# Altium project Bridge load.PrjPcb
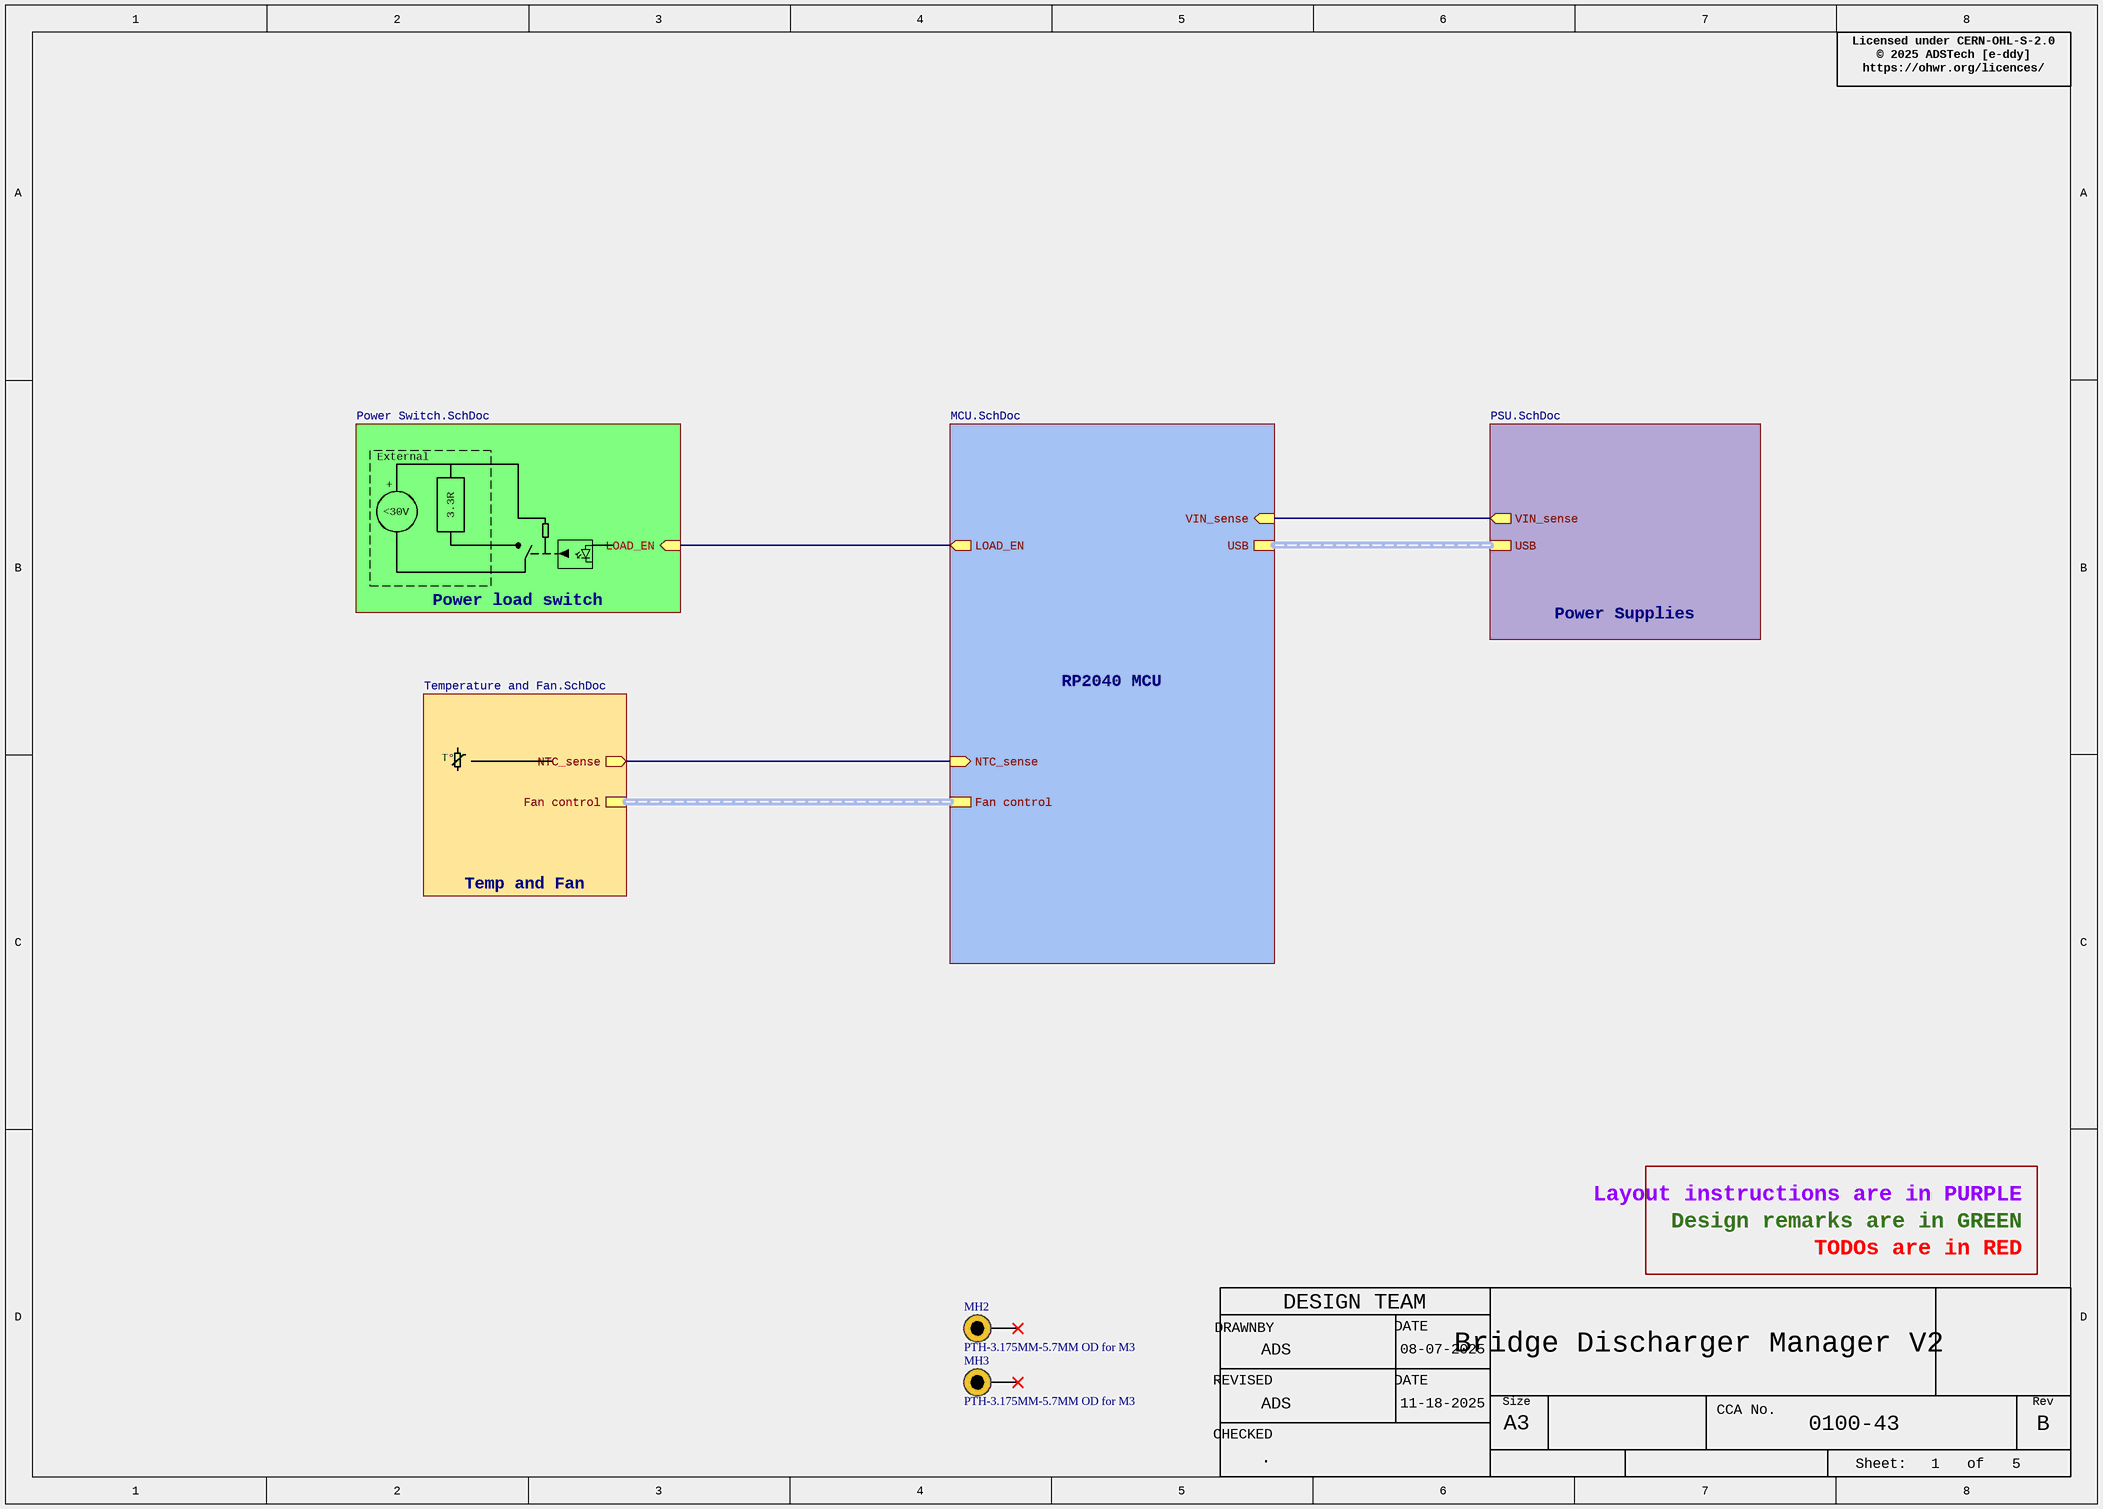
[diagram p0: Block diagram.SchDoc]
FIME_REVISED_DATE: 11-18-2025; FIME_REVISEDBY: ADS; FIME_DRAWN_DATE: 08-07-2025; FIME_DRAWNBY: ADS; FIME_CHECKEDBY: .; FIME_CCA_REVISION: B; FIME_CCA_Number: 0100-43; FIME_CCA_Description: Bridge Discharger Manager V2
5 sheets, 88 parts. Net scope: hierarchical (ports join the sheet entries above them; power ports are global).
Board file: Bridge Load V2.PcbDoc
Sheets:
  Block diagram.SchDoc
    Power load switch = Power Switch.SchDoc
    Power Supplies = PSU.SchDoc
    RP2040 MCU = MCU.SchDoc
    Temp and Fan = Temperature and Fan.SchDoc

## Sheet Block diagram.SchDoc
size A3; SheetNumber: 1; SheetTotal: 5

### Parts
MH2  PTH-3.175MM-5.7MM OD for M3  [PTH-3.175MM-5.7MM]  (net tie, no BOM)
MH3  PTH-3.175MM-5.7MM OD for M3  [PTH-3.175MM-5.7MM]  (net tie, no BOM)

### Sub-sheets
Power load switch = Power Switch.SchDoc: LOAD_EN (in)
Power Supplies = PSU.SchDoc: VIN_sense (out), USB (harness USB)
RP2040 MCU = MCU.SchDoc: Fan control (harness FAN_ctrl), LOAD_EN (out), NTC_sense (in), USB (harness USB), VIN_sense (in)
Temp and Fan = Temperature and Fan.SchDoc: Fan control (harness FAN_ctrl), NTC_sense (out)

### Nets
LOAD_EN: sheet Power load switch/LOAD_EN, sheet RP2040 MCU/LOAD_EN
NTC+: sheet RP2040 MCU/NTC_sense, sheet Temp and Fan/NTC_sense
VIN_sense: sheet Power Supplies/VIN_sense, sheet RP2040 MCU/VIN_sense

Not connected (* = marked no-connect by the designer): MH2 0*; MH3 0*

### Buses and harness runs
harness sheet Power Supplies/USB = sheet RP2040 MCU/USB
harness sheet RP2040 MCU/Fan control = sheet Temp and Fan/Fan control

### Notes on the sheet
- Licensed under CERN-OHL-S-2.0
  © 2025 ADSTech [e-ddy]
  https://ohwr.org/licences/
- External
- +
- <30V
- 3.3R
- T°
- Layout instructions are in PURPLE
- Design remarks are in GREEN
- TODOs are in RED
- DESIGN TEAM
- REVISED
- DRAWNBY
- DATE
- CHECKED
- Size
- A3
- CCA No.
- Sheet:
- of
- Rev

### Library data of the parts
MH2 MH3 = CMP-015-000006-2: 3.175mm/5.7mm PLATED TROUGH HOLE. For M3 Cylindrical hex screw head

## Sheet Power Switch.SchDoc
size A3; SheetNumber: 3; SheetTotal: 5
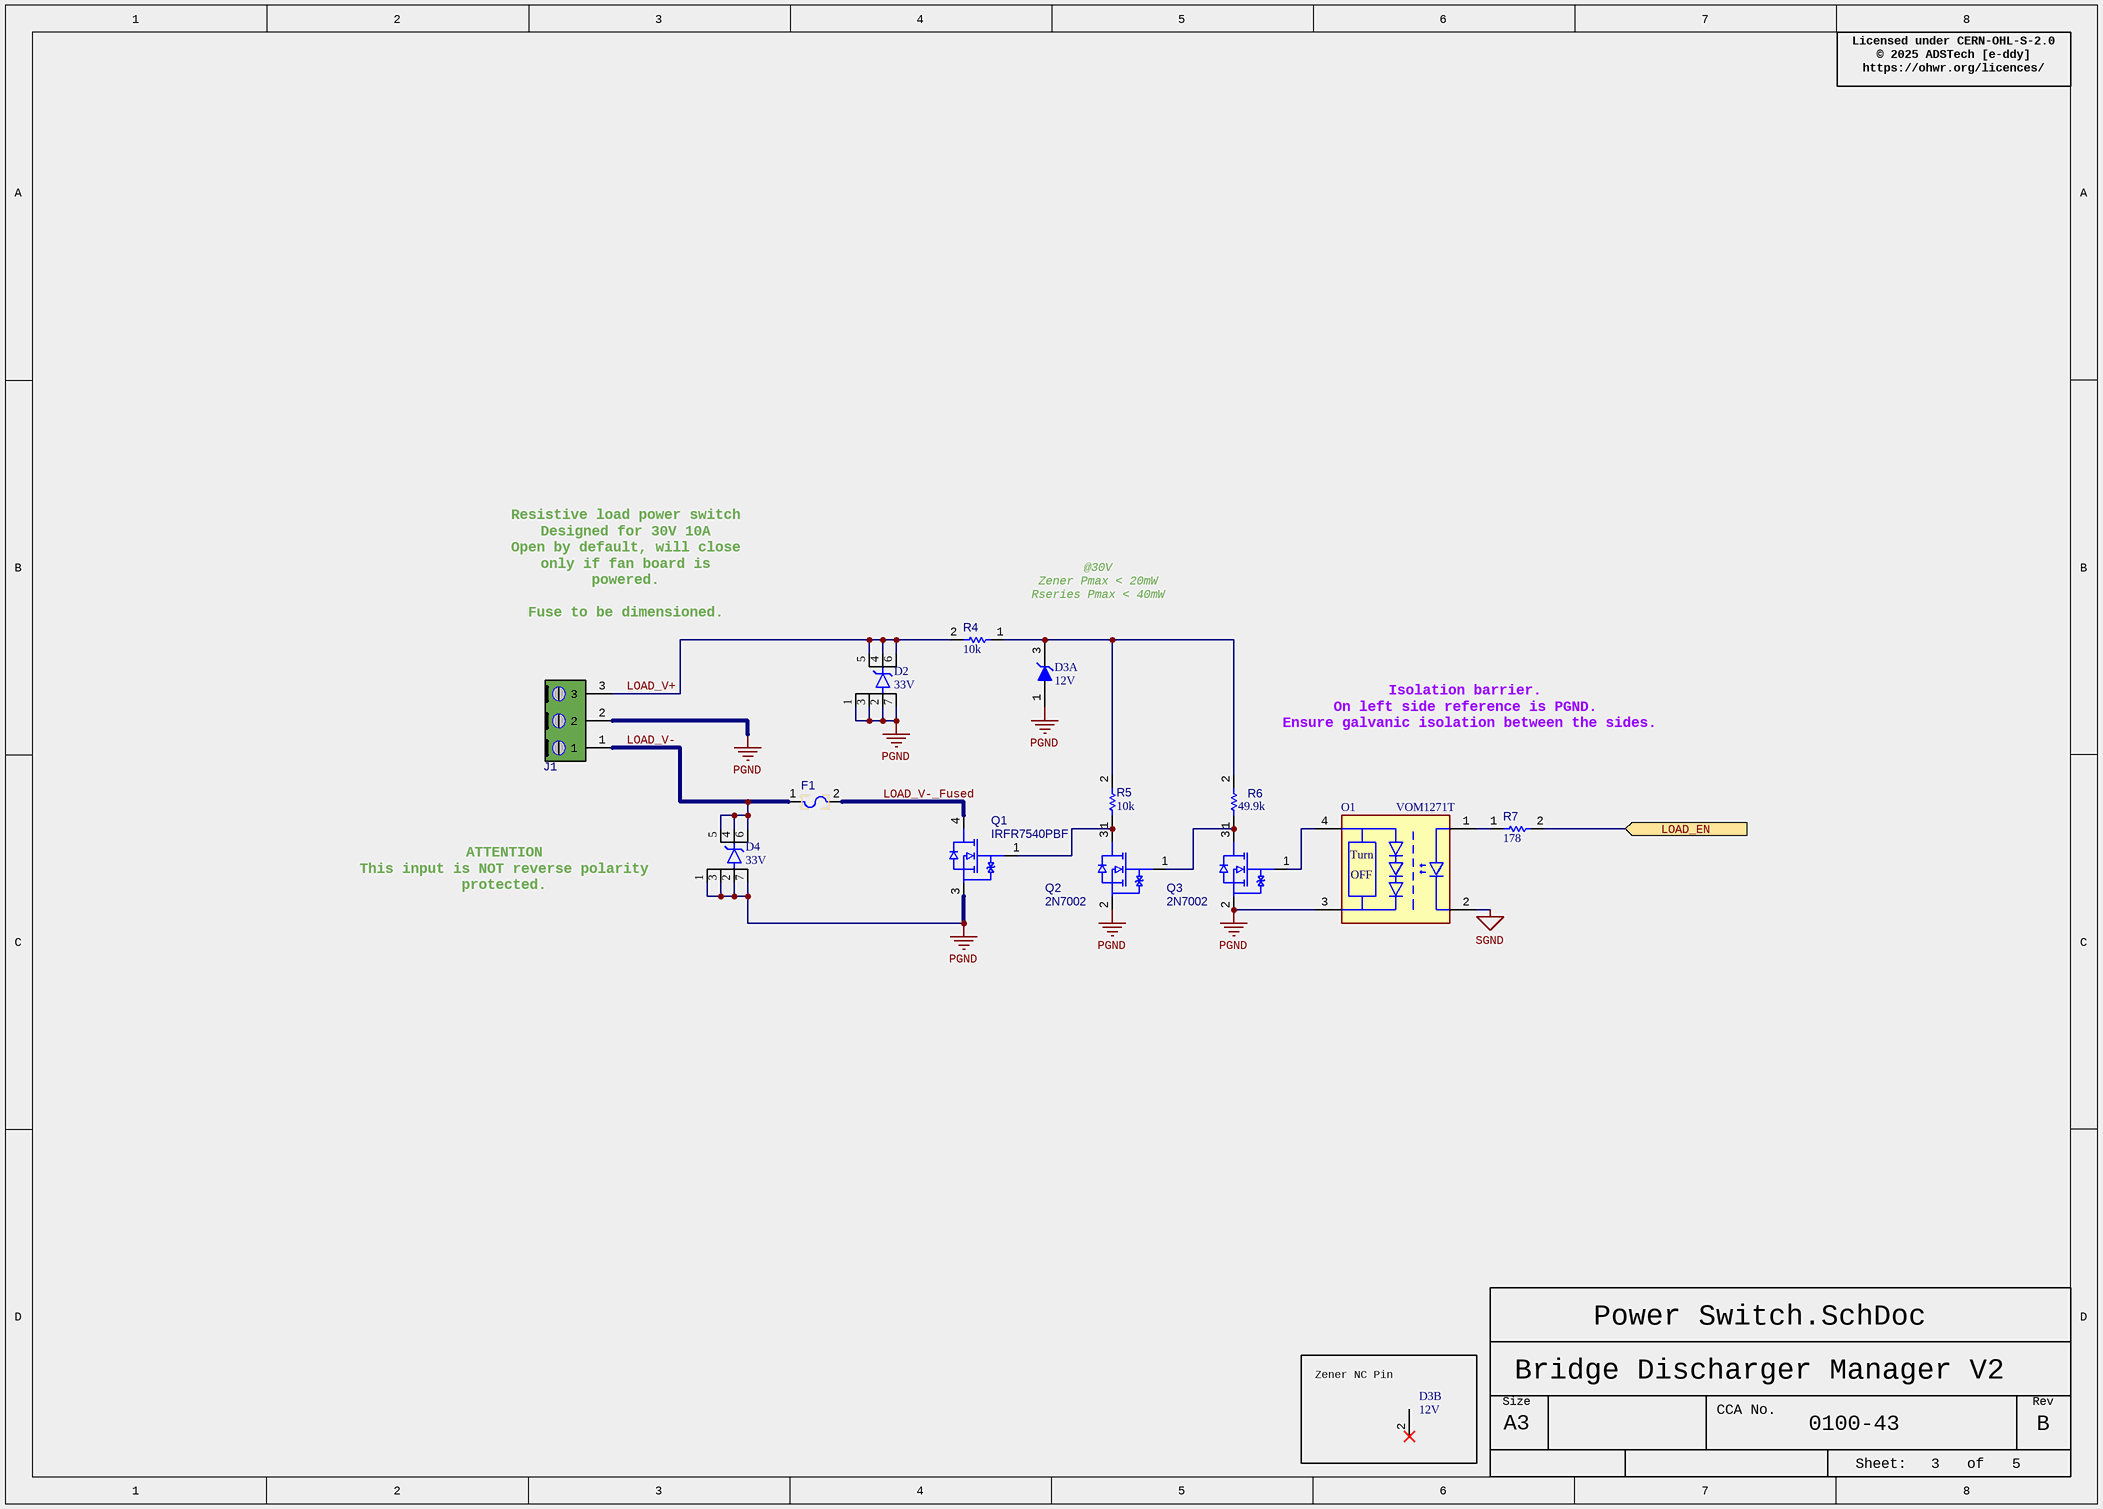
[diagram p1: Power Switch.SchDoc]

### Parts
D2  33V  [FP-DRV0006A-MFG]
D3  Reference Voltage-Nom: 12V  [FP-SOT23-MFG]  (hidden comment: D-ZEN-12V-BZX84C12-7-F)  (parts A,B of 2)
D4  33V  [FP-DRV0006A-MFG]
F1  FUSE-HOLDER-Nanofuse  [FP-0155-MFG]  (value not drawn)
J1  CON-TERM-3-5.08-30/12AWG  [TBJ05-03-1-G-G-Footprint-1]  (value not drawn)
O1  VOM1271T  [IC-Optocoupler-VOM1271T-Footprint-1]
Q1  IRFR7540PBF  [FP-PG-TO252-3-MFG]
Q2  2N7002  [FP-SOT23-MFG]
Q3  2N7002  [FP-SOT23-MFG]
R4  value 10k  [RES-0603-IPC_B]  (hidden comment: R-0603-10000.0-1%-100ppm-0.1)
R5  value 10k  [RES-0603-IPC_B]  (hidden comment: R-0603-10000.0-1%-100ppm-0.1)
R6  value 49.9k  [RES-0603-IPC_B]  (hidden comment: R-0603-49900.0-1%-100ppm-0.1)
R7  value 178  [RES-0603-IPC_B]  (hidden comment: R-0603-178.0-1%-100ppm-0.1)

### Blocks framed on the sheet
Zener NC Pin: D3

### Ports
LOAD_EN (in, see Block diagram[3B], MCU[2C])

### Nets
PGND: D2.1(GND) D2.2(GND) D2.3(GND) D2.7(GND) D3.1(A) D4.1(GND) D4.2(GND) D4.3(GND) D4.7(GND) J1.2 O1.3(S) Q1.3(S) Q2.2(S) Q3.2(S)
SGND: O1.2(K)
LOAD_EN: R7.2 ; port LOAD_EN
LOAD_V+: D2.4(IN) D2.5(IN) D2.6(IN) J1.3 R4.2
LOAD_V-: D4.4(IN) D4.5(IN) D4.6(IN) F1.1 J1.1
LOAD_V-_Fused: F1.2 Q1.4(D)
NetD3_3: D3.3(C) R4.1 R5.2 R6.2
NetO1_1: O1.1(A) R7.1
NetO1_4: O1.4(D) Q3.1(G)
NetQ1_1: Q1.1(G) Q2.3(D) R5.1
NetQ2_1: Q2.1(G) Q3.3(D) R6.1

Not connected (* = marked no-connect by the designer): D3 2(NC)*

### Notes on the sheet
- Licensed under CERN-OHL-S-2.0
  © 2025 ADSTech [e-ddy]
  https://ohwr.org/licences/
- Resistive load power switch
  Designed for 30V 10A
  Open by default, will close only if fan board is powered.
  Fuse to be dimensioned.
- @30V
  Zener Pmax < 20mW
  Rseries Pmax < 40mW
- Isolation barrier.
  On left side reference is PGND.
  Ensure galvanic isolation between the sides.
- (near D4) ATTENTION
  This input is NOT reverse polarity protected.
- Size
- A3
- CCA No.
- Sheet:
- of
- Rev
- (in symbol CMP-00026-00001-1) Turn; OFF

### Library data of the parts
D2 D4 = CMP-004-00011-2: Trans Voltage Suppressor Diode, 33V V(RWM), Unidirectional, Silicon; Reach SVHC Compliant: Yes; Diode Type: TRANS VOLTAGE SUPPRESSOR; JESD-609 Code: e4; RoHS Compliant: Yes; Peak Reflow Temperature (Cel): 260°C; Terminal Finish: Nickel; Moisture Sensitivity Level: 2
D3 = CMP-004-00009-2: Zener Diode, 12V V(Z), 5.39%, 0.35W, Silicon, Unidirectional; Number of Elements: 1; Qualification Status: Not Qualified; Additional Feature: HIGH RELIABILITY; Package Body Material: Plastic; Max Power Dissipation: 350mW; Dynamic Impedance-Max: 25R; Test Current: 5mA; Time @ Peak Reflow Temperature-Max (s): 40s; Terminal Form: Gull Wing; Max Operating Temperature: 150°C; Diode Element Material: SILICON; RoHS Compliant: Yes; Min Operating Temperature: -65°C; JESD-30 Code: R-PDSO-G3; Package Shape: Rectangular; Reach SVHC Compliant: Yes; Moisture Sensitivity Level: 1; Surface Mount: Yes; Terminal Position: DUAL; Diode Type: ZENER; Technology: ZENER; JESD-609 Code: e3; Voltage Tol-Max: 5.39%; Polarity: Unidirectional; Package Style: SMALL OUTLINEMeter; Peak Reflow Temperature (Cel): 260°C; Pins: 3; Terminal Finish: Tin
F1 = CMP-005-00003-1: Fuses/Accessories
J1 = CMP-002-00037-2: Terminal Block, Wtb, 3POS, 30-12AWG;
O1 = CMP-00026-00001-1: Buffer/Inverter Based MOSFET Driver, 0.000007A, PDSO4; Channels: 1; Package Body Material: Plastic; High Side Driver: No; Interface IC Type: BUFFER OR INVERTER BASED MOSFET DRIVER; RoHS Compliant: Yes; Length: 4.57mm; Terminal Position: DUAL; Temperature Grade: INDUSTRIAL; Height - Seated (Max): 2.42mm; Max Operating Temperature: 100°C; Package Shape: Rectangular; Pins: 4; Terminal Pitch: 2.54mm; JESD-30 Code: R-PDSO-G4; Width: 4.42mm; Min Operating Temperature: -40°C; Surface Mount: Yes; Case/Package: SOP; Package Style: SMALL OUTLINEMeter; Terminal Form: Gull Wing
Q1 = CMP-013-00011-1: Power Field-Effect Transistor; Moisture Sensitivity Level: 1; RoHS Compliant: Yes; Reach SVHC Compliant: Yes
Q2 Q3 = CMP-013-00012-1: Small Signal Field-Effect Transistor, 0.115A I(D), 60V, 1-Element, N-Channel, Silicon, Metal-oxide Semiconductor FET; Feedback Cap-Max (Crss): 5pF; Drain-source On Resistance-Max: 13.5R; Time @ Peak Reflow Temperature-Max (s): 40s; Transistor Application: SWITCHING; Package Body Material: Plastic; Qualification Status: Not Qualified; Power Dissipation-Max (Abs): 300mW; Number of Elements: 1; Drain Current-Max (ID): 115mA; Operating Mode: ENHANCEMENT MODE; JESD-609 Code: e3; Polarity/Channel Type: N-CHANNEL; JESD-30 Code: R-PDSO-G3; Package Style: SMALL OUTLINEMeter; Pins: 3; FET Technology: METAL-OXIDE SEMICONDUCTOR; Max Operating Temperature: 150°C; Terminal Finish: Tin; Surface Mount: Yes; Peak Reflow Temperature (Cel): 260°C; DS Breakdown Voltage-Min: 60V; Transistor Element Material: SILICON; Reach SVHC Compliant: Yes; Package Shape: Rectangular; RoHS Compliant: Yes; Moisture Sensitivity Level: 1; Terminal Form: Gull Wing; Terminal Position: DUAL; Drain Current-Max (Abs) (ID): 115mA
R4 R5 = RES-0603-00288-2: 0603 10000.0 Ω 1% 100ppm 0.1W Resistor; MPN: CRCW060310K0FKED; TCR: 100; Power: 100mW; Package: 0603; Tolerance: 1%
R6 = RES-0603-00355-2: 0603 49900.0 Ω 1% 100ppm 0.1W Resistor; MPN: CRCW060349K9FKED; TCR: 100; Power: 100mW; Tolerance: 1%; Package: 0603
R7 = RES-0603-00120-2: 0603 178.0 Ω 1% 100ppm 0.1W Resistor; MPN: CRCW0603178RFKED; Power: 100mW; TCR: 100; Package: 0603; Tolerance: 1%

## Sheet PSU.SchDoc
size A3; SheetNumber: 2; SheetTotal: 5
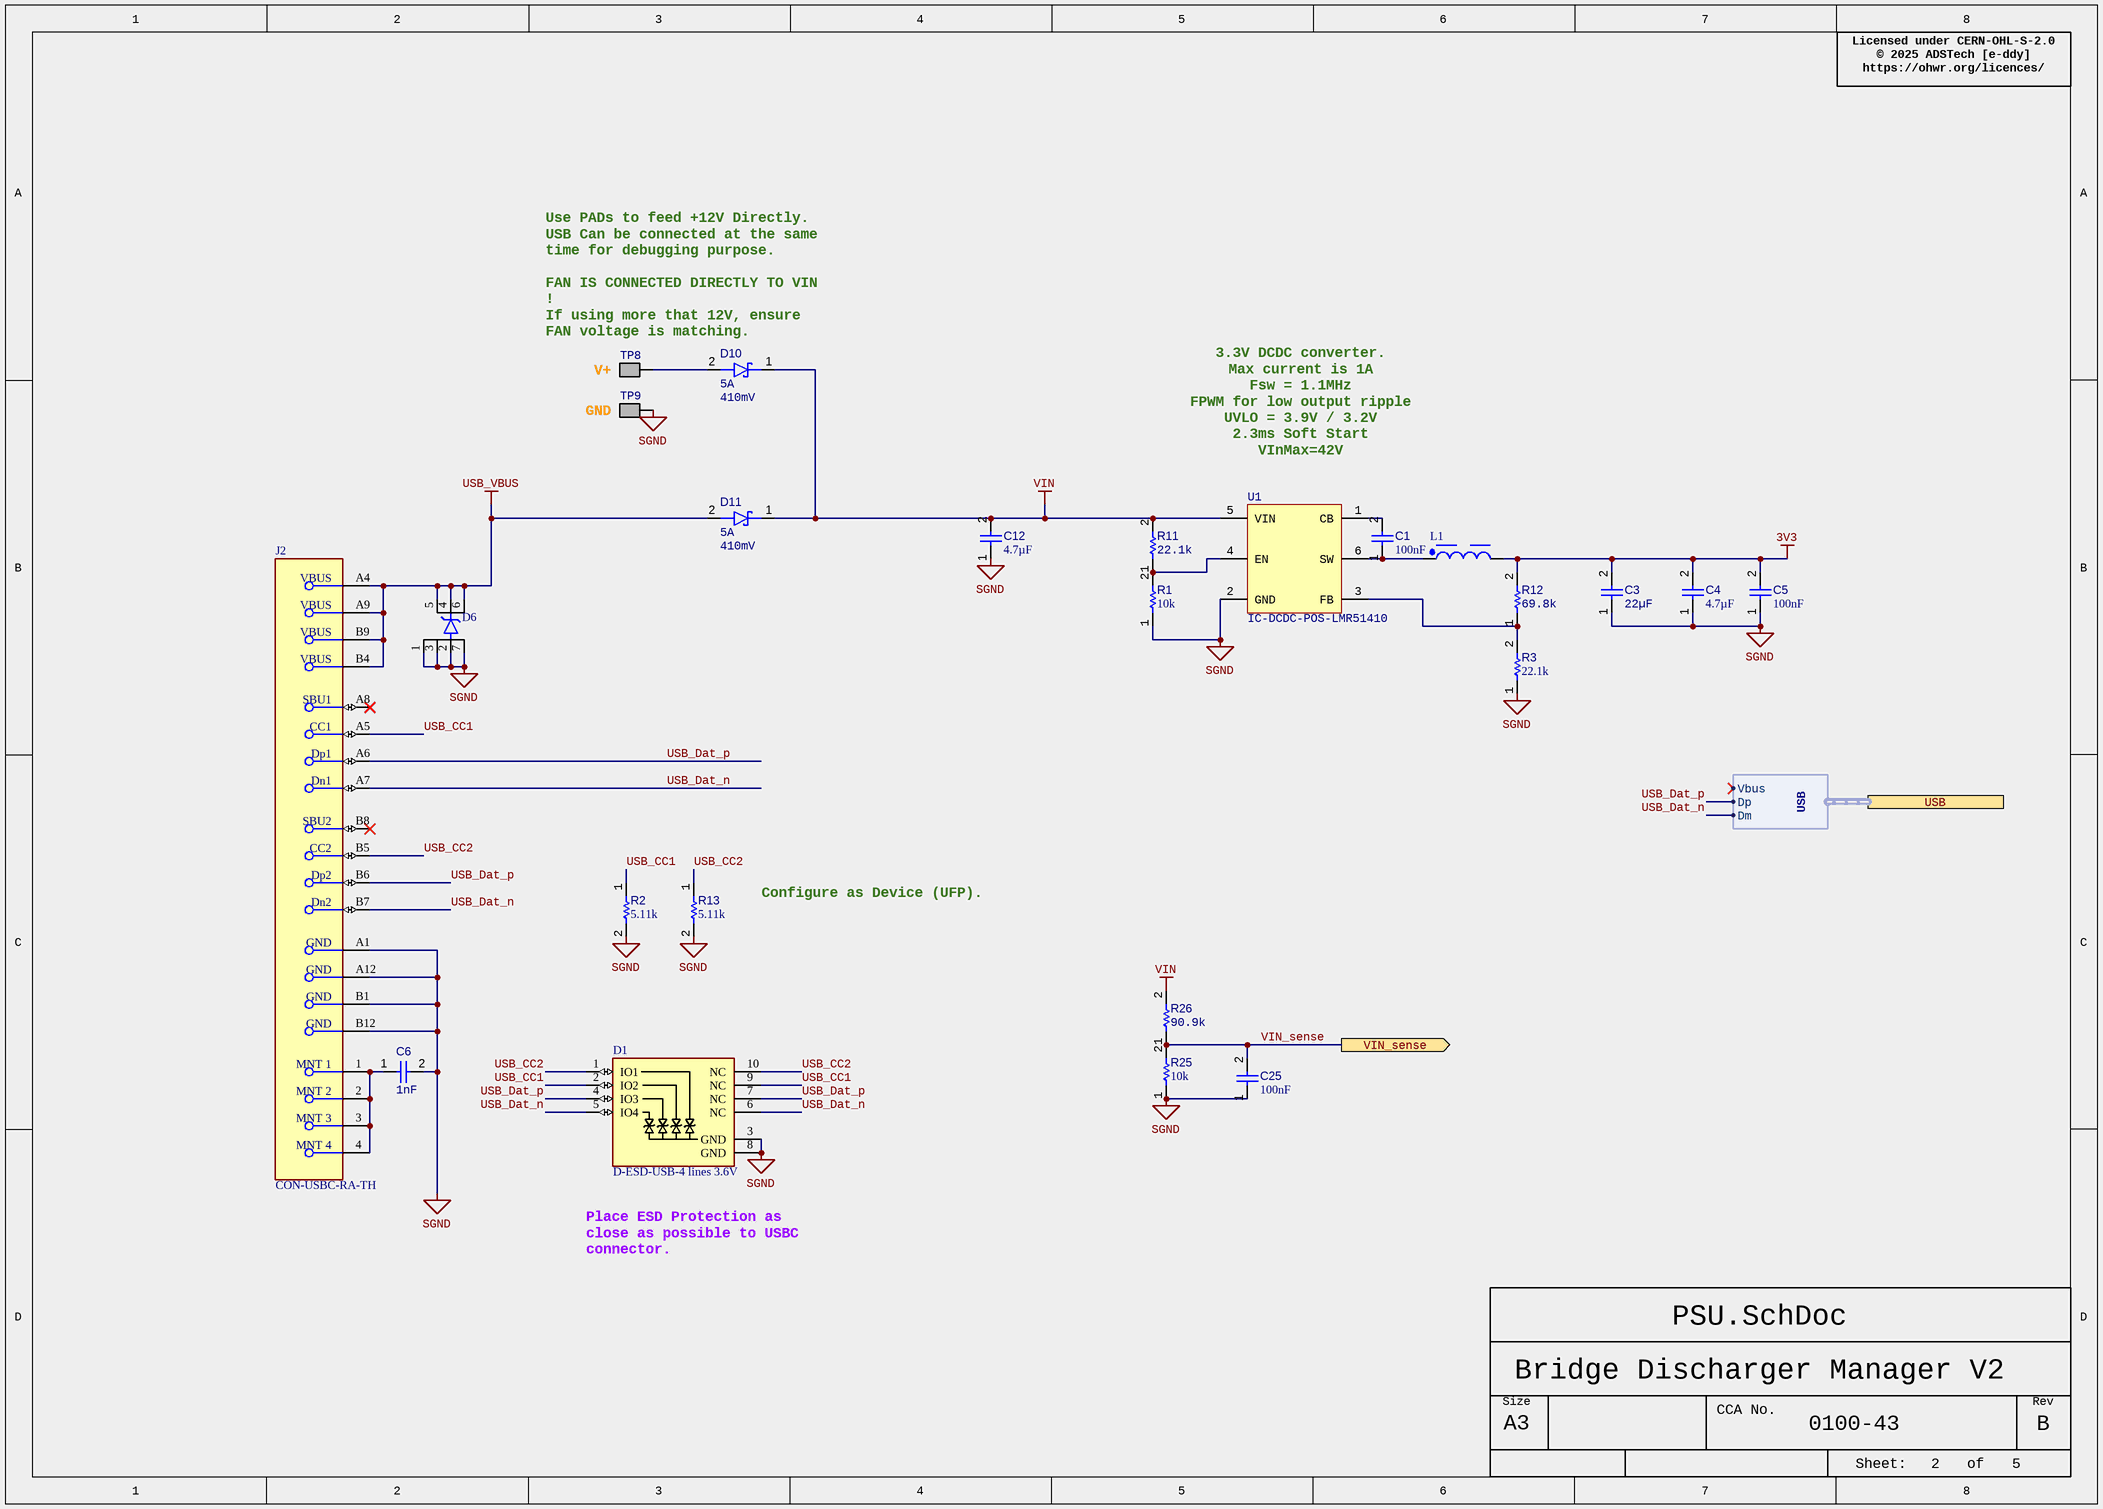
[diagram p2: PSU.SchDoc]

### Parts
C1  value 100nF  [CAP_0402-IPC_B]  (hidden comment: C-0402-CER-X7R-100nF-10%-50V)
C3  value 22µF  [FP-GRM21B-0_2-e0_2_0_7-MFG]  (hidden comment: C-0805-CER-X5R-22µF-25V)
C4  value 4.7µF  [FP-C2012X7R1H475K125AC-IPC_B]  (hidden comment: C-0805-CER-X7R-4,7µF-10%-50V)
C5  value 100nF  [CAP_0402-IPC_B]  (hidden comment: C-0402-CER-X7R-100nF-10%-50V)
C6  value 1nF  [CAP-1206-IPC_B]  (hidden comment: C-1206-CER-X7R-1nF-10%-1kV)
C12  value 4.7µF  [FP-C2012X7R1H475K125AC-IPC_B]  (hidden comment: C-0805-CER-X7R-4,7µF-10%-50V)
C25  value 100nF  [CAP_0402-IPC_B]  (hidden comment: C-0402-CER-X7R-100nF-10%-50V)
D1  D-ESD-USB-4 lines 3.6V  [FP-DQA0010A-MFG]
D6  D-TVS-14V-TVS1400DRVR  [FP-DRV0006A-MFG]  (value not drawn)
D10  Forward Current: 5A  Forward Voltage: 410mV  [FP-S8-V-3915_01-001-CATHO-MFG]  (hidden comment: D-SCH-VSSAF5N50-DO-221AD-2-5A-50V)
D11  Forward Current: 5A  Forward Voltage: 410mV  [FP-S8-V-3915_01-001-CATHO-MFG]  (hidden comment: D-SCH-VSSAF5N50-DO-221AD-2-5A-50V)
J2  CON-USBC-RA-TH  [FP-USB4085-GF-A-MFG]
L1  L-2424-22uH-2.1A-74404064220  [WE-LQS_6045]  (value not drawn)
R1  value 10k  [RES-0402-IPC_B]  (hidden comment: R-0402-10000.0-1%-100ppm-0.5)
R2  value 5.11k  [RES-0402-IPC_B]  (hidden comment: R-0402-5110.0-1%-100ppm-0.5)
R3  value 22.1k  [RES-0402-IPC_B]  (hidden comment: R-0402-22100.0-1%-100ppm-0.5)
R11  value 22.1k  [RES-0402-IPC_B]  (hidden comment: R-0402-22100.0-1%-100ppm-0.5)
R12  value 69.8k  [RES-0402-IPC_B]  (hidden comment: R-0402-69800.0-0.1%-25ppm-0.016)
R13  value 5.11k  [RES-0402-IPC_B]  (hidden comment: R-0402-5110.0-1%-100ppm-0.5)
R25  value 10k  [RES-0402-IPC_B]  (hidden comment: R-0402-10000.0-1%-100ppm-0.5)
R26  value 90.9k  [RES-0402-IPC_B]  (hidden comment: R-0402-90900.0-1%-100ppm-0.5)
TP8  Name: V+  [3x2 pad]  (hidden comment: SMT-PAD-3x2)  (no BOM)
TP9  Name: GND  [3x2 pad]  (hidden comment: SMT-PAD-3x2)  (no BOM)
U1  IC-DCDC-POS-LMR51410  [ETA-SOT23-6_N]

### Ports
USB (harness USB, see Block diagram[6B], MCU[6A]), VIN_sense (out, see Block diagram[6B], MCU[2C])

### Harnesses
USB: Vbus, Dm, Dp

### Nets
3V3: C3.2 C4.2 C5.2 L1.2 R12.2
SGND: C3.1 C4.1 C5.1 C6.2 C12.1 C25.1 D1.3(GND) D1.8(GND) D6.1(GND) D6.2(GND) D6.3(GND) D6.7(GND) J2.A1(GND) J2.A12(GND) J2.B1(GND) J2.B12(GND) R1.1 R2.2 R3.1 R13.2 R25.1 TP9.1 U1.2(GND)
USB_VBUS: D6.4(IN) D6.5(IN) D6.6(IN) D11.2(A) J2.A4(VBUS) J2.A9(VBUS) J2.B4(VBUS) J2.B9(VBUS)
VIN: C12.2 D10.1(K) D11.1(K) R11.2 R26.2 U1.5(VIN)
USB_CC1: D1.2(IO2) D1.9(NC) J2.A5(CC1) R2.1
USB_CC2: D1.1(IO1) D1.10(NC) J2.B5(CC2) R13.1
USB_Dat_n: D1.5(IO4) D1.6(NC) J2.A7(Dn1) J2.B7(Dn2) ; port USB.Dm
USB_Dat_p: D1.4(IO3) D1.7(NC) J2.A6(Dp1) J2.B6(Dp2) ; port USB.Dp
VIN_sense: C25.2 R25.2 R26.1 ; port VIN_sense
NetC1_1: C1.1 L1.1 U1.6(SW)
NetC1_2: C1.2 U1.1(CB)
NetC6_1: C6.1 J2.1(MNT_1) J2.2(MNT_2) J2.3(MNT_3) J2.4(MNT_4)
NetD10_2: D10.2(A) TP8.1
NetR1_2: R1.2 R11.1 U1.4(EN)
NetR3_2: R3.2 R12.1 U1.3(FB)

Not connected (* = marked no-connect by the designer): J2 A8(SBU1)* B8(SBU2)*

### Notes on the sheet
- Licensed under CERN-OHL-S-2.0
  © 2025 ADSTech [e-ddy]
  https://ohwr.org/licences/
- Use PADs to feed +12V Directly. USB Can be connected at the same time for debugging purpose.
  FAN IS CONNECTED DIRECTLY TO VIN !
  If using more that 12V, ensure FAN voltage is matching.
- 3.3V DCDC converter.
  Max current is 1A
  Fsw = 1.1MHz
  FPWM for low output ripple
  UVLO = 3.9V / 3.2V
  2.3ms Soft Start
  VInMax=42V
- Configure as Device (UFP).
- Place ESD Protection as close as possible to USBC connector.
- Size
- A3
- CCA No.
- Sheet:
- of
- Rev

### Library data of the parts
C1 C5 C25 = CMP-001-00003-5: Multilayer Ceramic Capacitor, 0.1 uF, 50 V, ± 10%, X7R, 0402 [1005 Metric]; Voltage Rating: 50V; Package Quantity: 50000; Pins: 2; Case Code (Imperial): 0402; RoHS Compliant: Yes; Voltage Rating (DC): 50V; Series: GRM; Max Operating Temperature: 125°C; Dielectric: X7R; Length: 0.039inch; Packaging: Tape and Reel; Thickness: 0.022inch; Material: Ceramic; Mounting Technology: Surface Mount; Tolerance: 10%; Lead Free: Lead Free; Case Code (Metric): 1005; Case/Package: 0402; Width: 0.02inch; Termination: SMD/SMT; Weight: 0.000212oz; Min Operating Temperature: -55°C; Height: 0.5mm
C3 = CMP-001-00016-1: Ceramic Capacitor, Multilayer, Ceramic, 25V, 20% +Tol, 20% -Tol, X5R, 15% TC, 22uF, Surface Mount, 0805; Multilayer: Yes; Pins: 2; Termination: Wraparound; Tolerance (fill in as +-): 20%; Width: 1.25mm; JESD-609 Code: e3; Dielectric Material: Ceramic; Max Operating Temperature: 85°C; Min Operating Temperature: -55°C; Rated DC Voltage (URdc): 25V; Reach SVHC Compliant: Yes; Terminal Finish: Nickel; Packaging: Tape and Reel; Height: 1.25mm; Length: 2mm; RoHS Compliant: Yes; Package Style: SMTMeter; Case/Package: 0805; Capacitor Type: Ceramic; Package Shape: Rectangular; Tolerance  (fill in as +-): 20%; Mounting Technology: Surface Mount; Temperature Characteristics Code: X5R
C4 C12 = CMP-001-00011-4: Ceramic Capacitor, Multilayer, Ceramic, 50V, 10% +Tol, 10% -Tol, X7R, 15% TC, 4.7uF, Surface Mount, 0805; Case/Package: 0805; Pins: 2; Capacitor Type: Ceramic; RoHS Compliant: Yes
C6 = CMP-001-00041-1: Ceramic Capacitor, Multilayer, Ceramic, 1000V, 10% +Tol, 10% -Tol, X7R, 15% TC, 0.001uF, Surface Mount, 1206; Rated DC Voltage (URdc): 1kV; Multilayer: Yes; Reference Standard: AEC-Q200; Dielectric Material: Ceramic; Tolerance  (fill in as +-): 10%; Height: 1.25mm; Capacitor Type: Ceramic; Mounting Technology: Surface Mount; Termination: Wraparound; Max Operating Temperature: 125°C; Packaging: Tape and Reel; Length: 3.2mm; Reach SVHC Compliant: Yes; Package Style: SMTMeter; RoHS Compliant: Yes; Temperature Characteristics Code: X7R; Width: 1.6mm; Min Operating Temperature: -55°C; Tolerance (fill in as +-): 10%; Case/Package: 1206; Package Shape: Rectangular; Pins: 2
D1 = CMP-004-00014-1: Trans Voltage Suppressor Diode, 17W, 3.6V V(RWM), Bidirectional, 4 Element, Silicon; Reference Standard: IEC-61000-4-2; Terminal Finish: Nickel; Moisture Sensitivity Level: 1; JESD-609 Code: e4; Reach SVHC Compliant: Yes; Diode Type: TRANS VOLTAGE SUPPRESSOR; RoHS Compliant: Yes
D6 = CMP-004-00013-2: Trans Voltage Suppressor Diode, 14V V(RWM), Unidirectional, Silicon; Telecom IC Type: SURGE PROTECTION CIRCUIT; JESD-609 Code: e4; RoHS Compliant: Yes; Terminal Finish: Nickel; Reach SVHC Compliant: Yes; Moisture Sensitivity Level: 2
D10 D11 = CMP-004-00001-2: Rectifier Diode, Schottky, 1 Phase, 1 Element, 5A, 50V V(RRM), Silicon, DO-221AC; Number of Phases: 1; Non-rep Pk Forward Current-Max: 100A; Max Reverse Current: 1.4mA; Application(s): EFFICIENCY; Package Body Material: Plastic; JEDEC-95 Code: DO-221AC; Terminal Position: DUAL; Terminal Form: Flat; JESD-609 Code: e3; Technology: SCHOTTKY; Diode Element Material: SILICON; Max Operating Temperature: 150°C; Surface Mount: Yes; Terminal Finish: Tin; Max Output current: 5A; Package Shape: Rectangular; Pins: 2; Package Style: SMALL OUTLINEMeter; Rep Pk Reverse Voltage-Max: 50V; RoHS Compliant: Yes; Diode Type: RECTIFIER; Case/Package: DO-221AC; Number of Elements: 1; JESD-30 Code: R-PDSO-F2; Min Operating Temperature: -40°C; Reach SVHC Compliant: Yes
J2 = CMP-002-00038-1: USB Connector, 16 Contact(s), Female, Right Angle, Solder Terminal, Receptacle
L1 = CMP-006-00011-1: General Purpose Inductor, 22uH, 20%, 1 Element, SMD, 2424; Self Resonant Frequency: 10MHz; Max Current Rating: 2.1A; Test Frequency: 100kHz; Inductor Application: POWER INDUCTOR; Shape/Size Description: RECTANGULAR PACKAGE; DC Resistance (DCR): 89mR; Channels: 1; Shielding: Unshielded; Case/Size Code: 2424; Reach SVHC Compliant: Yes; Surface Mount: Yes; Max Operating Temperature: 125°C; Terminal Placement: Dual Ended; Pins: 2; Case/Package: 2424; Tolerance: 20%; Current Rating: 2.1A; Min Operating Temperature: -40°C; Inductance-Nom (L): 22uH; RoHS Compliant: Yes; Termination: One Surface; Inductor Type: GENERAL PURPOSE INDUCTOR
R1 R25 = RES-0402-00288-6: 0402 10000.0 Ω 1% 100ppm 0.063W Resistor; MPN: RC0402FR-0710KL; Power: 63mW; TCR: 100ppm; Package: 0402; Tolerance: 1%
R2 R13 = RES-0402-00260-5: 0402 5110.0 Ω 1% 100ppm 0.063W Resistor; MPN: CRCW04025K11FKED; Power: 63mW; Tolerance: 1%; TCR: 100ppm; Package: 0402
R3 R11 = RES-0402-00321-5: 0402 22100.0 Ω 1% 100ppm 0.063W Resistor; MPN: CRCW040222K1FKED; Power: 63mW; TCR: 100ppm; Tolerance: 1%; Package: 0402
R12 = RES-0402-00658-3: 0402 69800.0 Ω 0.1% 25ppm 0.016W Resistor; Power: 16mW; Tolerance: 0.1; TCR: 25; Package: 0402
R26 = RES-0402-00380-5: 0402 90900.0 Ω 1% 100ppm 0.063W Resistor; MPN: CRCW040290K9FKED; Power: 63mW; TCR: 100ppm; Package: 0402; Tolerance: 1%
TP8 TP9 = CMP-00096-1: 3x2mm standard pad for wire soldering
U1 = CMP-019-00024-1: SIMPLE SWITCHER® 4V to 42V, 1A synchronous buck converter with 26.5uA IQ 6-SOT-23 -40 to 150

## Sheet MCU.SchDoc
size A3; SheetNumber: 4; SheetTotal: 5
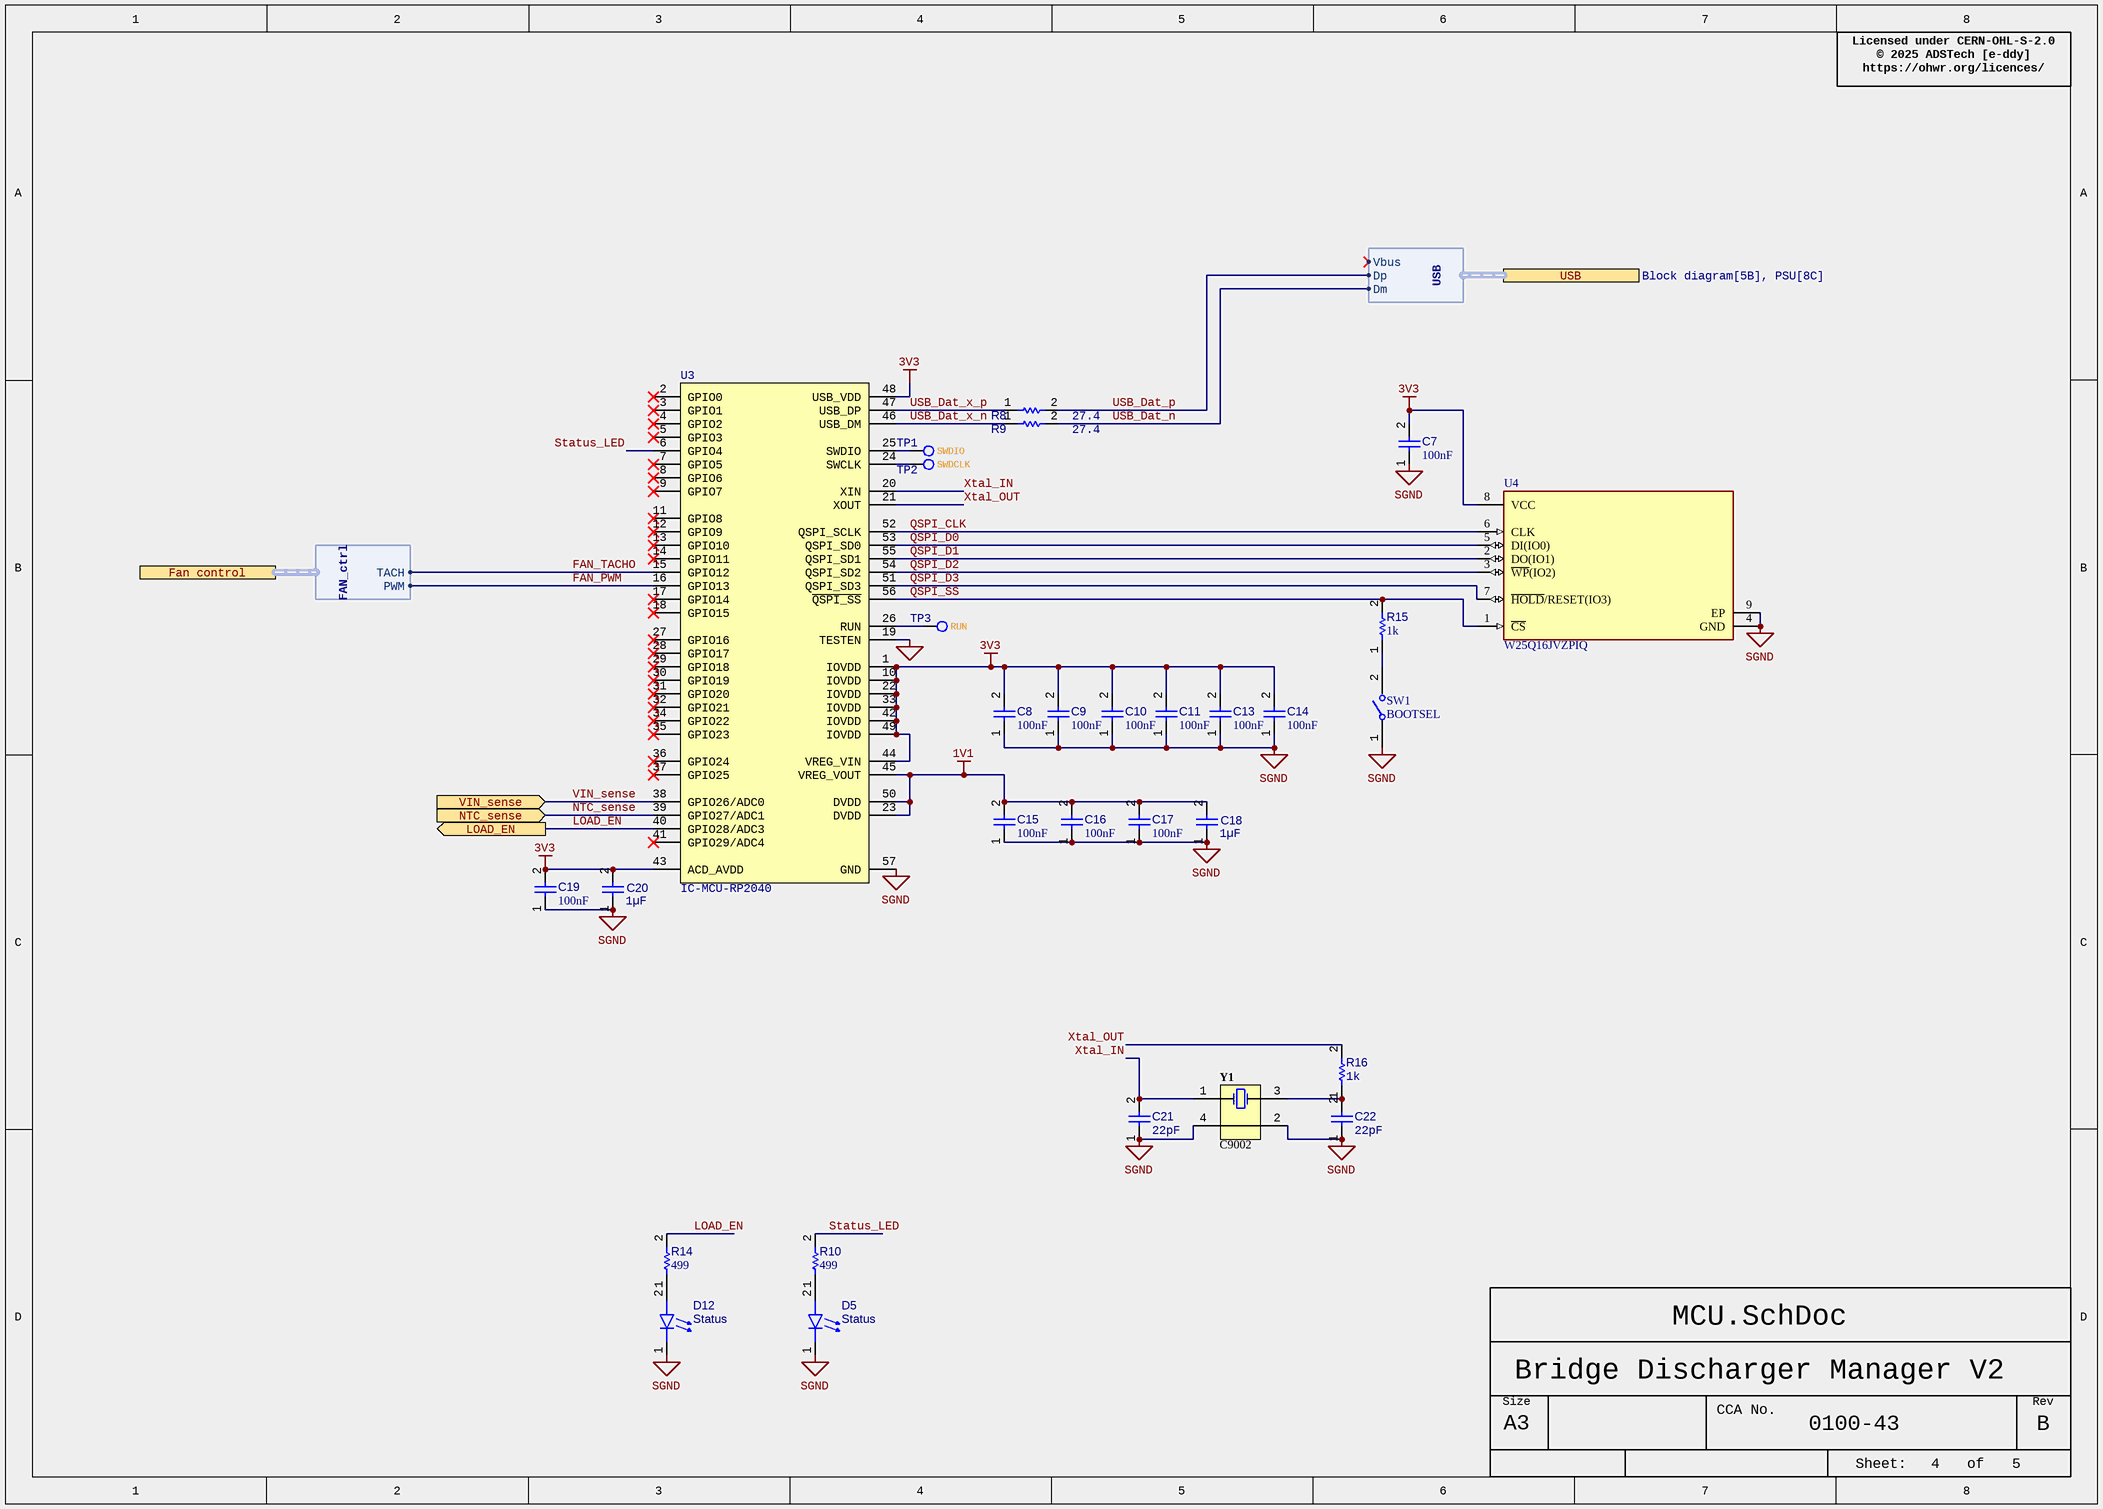
[diagram p3: MCU.SchDoc]

### Parts
C7  value 100nF  [CAP_0402-IPC_B]  (hidden comment: C-0402-CER-X7R-100nF-10%-50V)
C8  value 100nF  [CAP_0402-IPC_B]  (hidden comment: C-0402-CER-X7R-100nF-10%-50V)
C9  value 100nF  [CAP_0402-IPC_B]  (hidden comment: C-0402-CER-X7R-100nF-10%-50V)
C10  value 100nF  [CAP_0402-IPC_B]  (hidden comment: C-0402-CER-X7R-100nF-10%-50V)
C11  value 100nF  [CAP_0402-IPC_B]  (hidden comment: C-0402-CER-X7R-100nF-10%-50V)
C13  value 100nF  [CAP_0402-IPC_B]  (hidden comment: C-0402-CER-X7R-100nF-10%-50V)
C14  value 100nF  [CAP_0402-IPC_B]  (hidden comment: C-0402-CER-X7R-100nF-10%-50V)
C15  value 100nF  [CAP_0402-IPC_B]  (hidden comment: C-0402-CER-X7R-100nF-10%-50V)
C16  value 100nF  [CAP_0402-IPC_B]  (hidden comment: C-0402-CER-X7R-100nF-10%-50V)
C17  value 100nF  [CAP_0402-IPC_B]  (hidden comment: C-0402-CER-X7R-100nF-10%-50V)
C18  value 1µF  [CAP_0402-IPC_B]  (hidden comment: C-0402-CER-X5R-1µF-10%-25V)
C19  value 100nF  [CAP_0402-IPC_B]  (hidden comment: C-0402-CER-X7R-100nF-10%-50V)
C20  value 1µF  [CAP_0402-IPC_B]  (hidden comment: C-0402-CER-X5R-1µF-10%-25V)
C21  value 22pF  [CAP_0402-IPC_B]  (hidden comment: C-0402-C0G-22pF-50V-1%)
C22  value 22pF  [CAP_0402-IPC_B]  (hidden comment: C-0402-C0G-22pF-50V-1%)
D5  Status  [DIAL-0603-2_V]
D12  Status  [DIAL-0603-2_V]
R8  value 27.4  [RES-0402-IPC_B]  (hidden comment: R-0402-27.4-1%-100ppm-0.5)
R9  value 27.4  [RES-0402-IPC_B]  (hidden comment: R-0402-27.4-1%-100ppm-0.5)
R10  value 499  [RES-0402-IPC_B]  (hidden comment: R-0402-499.0-1%-100ppm-0.5)
R14  value 499  [RES-0402-IPC_B]  (hidden comment: R-0402-499.0-1%-100ppm-0.5)
R15  value 1k  [RES-0402-IPC_B]  (hidden comment: R-0402-1000.0-1%-100ppm-0.5)
R16  value 1k  [RES-0402-IPC_B]  (hidden comment: R-0402-1000.0-1%-100ppm-0.5)
SW1  BOOTSEL  [FP-B3U-1000P-MFG]
TP1  Name: SWDIO  [1.2mm test point - direct connect]  (hidden comment: TP-DIRECT-1.2mm)  (no BOM)
TP2  Name: SWDCLK  [1.2mm test point - direct connect]  (hidden comment: TP-DIRECT-1.2mm)  (no BOM)
TP3  Name: RUN  [1.2mm test point - direct connect]  (hidden comment: TP-DIRECT-1.2mm)  (no BOM)
U3  IC-MCU-RP2040  [QFN40P700X700X90_HS-57N]
U4  W25Q16JVZPIQ  [FP-ZP-IPC_B]
Y1  C9002  [FP-ABM8-MFG]

### Ports
Fan control (harness FAN_ctrl, see Block diagram[4C], Temperature and Fan[3C]), LOAD_EN (out, see Block diagram[4B], Power Switch[7C]), NTC_sense (in, see Block diagram[4C], Temperature and Fan[3B]), USB (harness USB, see Block diagram[5B], PSU[8C]), VIN_sense (in, see Block diagram[5B], PSU[6C])

### Harnesses
FAN_ctrl: PWM, TACH
USB: Vbus, Dm, Dp

### Nets
1V1: C15.2 C16.2 C17.2 C18.2 U3.23(DVDD) U3.45(VREG_VOUT) U3.50(DVDD)
3V3: C7.2 C8.2 C9.2 C10.2 C11.2 C13.2 C14.2 C19.2 C20.2 U3.1(IOVDD) U3.10(IOVDD) U3.22(IOVDD) U3.33(IOVDD) U3.42(IOVDD) U3.43(ACD_AVDD) U3.44(VREG_VIN) U3.48(USB_VDD) U3.49(IOVDD) U4.8(VCC)
SGND: C7.1 C8.1 C9.1 C10.1 C11.1 C13.1 C14.1 C15.1 C16.1 C17.1 C18.1 C19.1 C20.1 C21.1 C22.1 D5.1(K) D12.1(K) SW1.1 U3.19(TESTEN) U3.57(GND) U4.4(GND) U4.9(EP) Y1.2 Y1.4
~{QSPI_SS}: R15.2 U3.56(~{QSPI_SS}) U4.1(~{CS})
FAN_PWM: U3.16(GPIO13) ; port Fan control.PWM
FAN_TACHO: U3.15(GPIO12) ; port Fan control.TACH
LOAD_EN: R14.2 U3.40(GPIO28/ADC3) ; port LOAD_EN
NTC_sense: U3.39(GPIO27/ADC1) ; port NTC_sense  [project net NTC+]
QSPI_CLK: U3.52(QSPI_SCLK) U4.6(CLK)
QSPI_D0: U3.53(QSPI_SD0) U4.5(DI(IO0))
QSPI_D1: U3.55(QSPI_SD1) U4.2(DO(IO1))
QSPI_D2: U3.54(QSPI_SD2) U4.3(~{WP}(IO2))
QSPI_D3: U3.51(QSPI_SD3) U4.7(~{HOLD}/RESET(IO3))
Status_LED: R10.2 U3.6(GPIO4)
USB_Dat_n: R9.2 ; port USB.Dm
USB_Dat_p: R8.2 ; port USB.Dp
USB_Dat_x_n: R9.1 U3.46(USB_DM)
USB_Dat_x_p: R8.1 U3.47(USB_DP)
VIN_sense: U3.38(GPIO26/ADC0) ; port VIN_sense
Xtal_IN: C21.2 U3.20(XIN) Y1.1
Xtal_OUT: R16.2 U3.21(XOUT)
NetC22_2: C22.2 R16.1 Y1.3
NetD5_2: D5.2(A) R10.1
NetD12_2: D12.2(A) R14.1
NetR15_1: R15.1 SW1.2
NetTP1_1: TP1.1 U3.25(SWDIO)
NetTP2_1: TP2.1 U3.24(SWCLK)
NetTP3_1: TP3.1 U3.26(RUN)

Not connected (* = marked no-connect by the designer): U3 2(GPIO0)* 3(GPIO1)* 4(GPIO2)* 5(GPIO3)* 7(GPIO5)* 8(GPIO6)* 9(GPIO7)* 11(GPIO8)* 12(GPIO9)* 13(GPIO10)* 14(GPIO11)* 17(GPIO14)* 18(GPIO15)* 27(GPIO16)* 28(GPIO17)* 29(GPIO18)* 30(GPIO19)* 31(GPIO20)* 32(GPIO21)* 34(GPIO22)* 35(GPIO23)* 36(GPIO24)* 37(GPIO25)* 41(GPIO29/ADC4)*

### Notes on the sheet
- Licensed under CERN-OHL-S-2.0
  © 2025 ADSTech [e-ddy]
  https://ohwr.org/licences/
- Size
- A3
- CCA No.
- Sheet:
- of
- Rev

### Library data of the parts
C7-C11 C13-C17 C19 = CMP-001-00003-5: as C1 on sheet PSU; Package Quantity: 50000; Pins: 2; Case Code (Imperial): 0402; RoHS Compliant: Yes; Voltage Rating (DC): 50V; Series: GRM; Max Operating Temperature: 125°C; Dielectric: X7R; Length: 0.039inch; Packaging: Tape and Reel; Thickness: 0.022inch; Material: Ceramic; Mounting Technology: Surface Mount; Tolerance: 10%; Lead Free: Lead Free; Case Code (Metric): 1005; Case/Package: 0402; Width: 0.02inch; Termination: SMD/SMT; Weight: 0.000212oz; Min Operating Temperature: -55°C; Height: 0.5mm
C18 C20 = CMP-001-00015-3: Ceramic Capacitor, Multilayer, Ceramic, 25V, 10% +Tol, 10% -Tol, X5R, 15% TC, 1uF, Surface Mount, 0402; Multilayer: Yes; Package Shape: Rectangular; Height: 0.5mm; Tolerance  (fill in as +-): 10%; Mounting Technology: Surface Mount; Pins: 2; Rated DC Voltage (URdc): 25V; Width: 0.5mm; Termination: Wraparound; Reach SVHC Compliant: Yes; Capacitor Type: Ceramic; Max Operating Temperature: 85°C; Temperature Characteristics Code: X5R; Terminal Finish: Nickel; Case/Package: 0402; Length: 1mm; Min Operating Temperature: -55°C; JESD-609 Code: e3; Packaging: Tape and Reel; Tolerance (fill in as +-): 10%; Dielectric Material: Ceramic; RoHS Compliant: Yes; Package Style: SMTMeter
C21 C22 = CMP-00074-3: Multilayer Ceramic Capacitors MLCC - SMD/SMT 50V 22pF C0G 0402 +/-1%; Tolerance: 1%; Package: 0402; Dielectric: C0G
D5 D12 = CMP-007-00005-2: Red 633nm 0603 LED; Forward Current: 20mA; Forward Voltage: 2.1V; Viewing Angle: 140; Reverse Voltage: 5; Max Power Dissipation: 72mW; Wavelength: 633; Case/Package: 0603; Max Operating Temperature: 100°C; RoHS Compliant: Yes; Colour: Red; Mounting Technology: SMT; Min Operating Temperature: -40°C; Nominal Vf: 2.1V; Pins: 2
R8 R9 = RES-0402-00042-5: 0402 27.4 Ω 1% 100ppm 0.063W Resistor; MPN: CRCW040227R4FKED; Power: 63mW; Package: 0402; Tolerance: 1%; TCR: 100ppm
R10 R14 = RES-0402-00163-5: 0402 499.0 Ω 1% 100ppm 0.063W Resistor; MPN: CRCW0402499RFKED; Power: 63mW; Tolerance: 1%; Package: 0402; TCR: 100ppm
R15 R16 = RES-0402-00192-5: 0402 1000.0 Ω 1% 100ppm 0.063W Resistor; MPN: CRCW04021K00FKED; Power: 63mW; TCR: 100ppm; Tolerance: 1%; Package: 0402
SW1 = CMP-011-00003-1: Keypad Switch, 1 Switches, SPST, Momentary-tactile, 0.05A, 12VDC, 1.99N, Solder Terminal, Surface Mount-straight; Body Breadth: 2.5mm; Body Length or Diameter: 3mm; Insulation Resistance: 100MR; Contact Bounce Time-Max: 5ms; Contact Voltage(DC)-Max: 12V; Contact Current(DC)-Max: 50mA; Dielectric Withstand Volts: 250VACV; Sealing: DUST PROOF; Contact Resistance: 0.1mR; Contact DC Max Rating R Load: .05A@12VDC; Additional Feature: ROHS COMPLIANT; Body Height: 1.2mm; Contact Function: (N.O.) (N.C.); Circuit Configuration: 1X1; Number of Switches: 1; Switch Function: SPST; Reach SVHC Compliant: Yes; Actuator Type: Keypad; Min Operating Temperature: -25°C; Switch Type: Keypad; Terminal Length: 0inch; Switch Action: MOMENTARY-TACTILE; Operating Force-Max: 1.99N; Max Operating Temperature: 70°C; Terminal Finish: Silver; Mounting Technology: Surface Mount; JESD-609 Code: e4; RoHS Compliant: Yes; Termination: Solder; Packaging: Tape and Reel
TP1-TP3 = CMP-00095-4: 1.2mm standard round test point with direct connect
U3 = CMP-020-00000-2: 264KB 30 133MHZ LQFN-56(7X7) Microcontrollers (mcu/mpu/soc) Rohs
U4 = CMP-78876-000010-1: IC FLASH 16MBIT SPI/QUAD 8WSON; Frequency: 133MHz; Memory Size: 16Mb; Memory Type: Non-Volatile; Packaging: Rail/Tube; Mount: Surface Mount; Min Operating Temperature: -40°C; Max Operating Temperature: 85°C
Y1 = CMP-003-00005-1: Crystal 12MHz ±20ppm (Tol) ±50ppm (Stability) 18pF FUND 120Ohm 4-Pin Ultra Mini-CSMD T/R; ESR: 120; ESR (Equivalent Series Resistance): 120R; Mounting Technology: Surface Mount; Width: 2.5mm; Reach SVHC Compliant: No; Termination: SMD/SMT; Frequency Tolerance: 20ppm; Tolerance: 20ppm; Pins: 4; Height: 0.8mm; Min Operating Temperature: -20°C; Packaging: Tape and Reel; Package Quantity: 1000; Operating Frequency: 12 MHz; Frequency: 12MHz; Lead Free: Lead Free; Load Capacitance: 18pF; Depth: 2.5mm; Max Operating Temperature: 70°C; Case/Package: CSMD; RoHS Compliant: Yes; Frequency Stability: 50ppm; Length: 3.2mm; Radiation Hardening: No; Series: ABM8

## Sheet Temperature and Fan.SchDoc
size A3; SheetNumber: 5; SheetTotal: 5
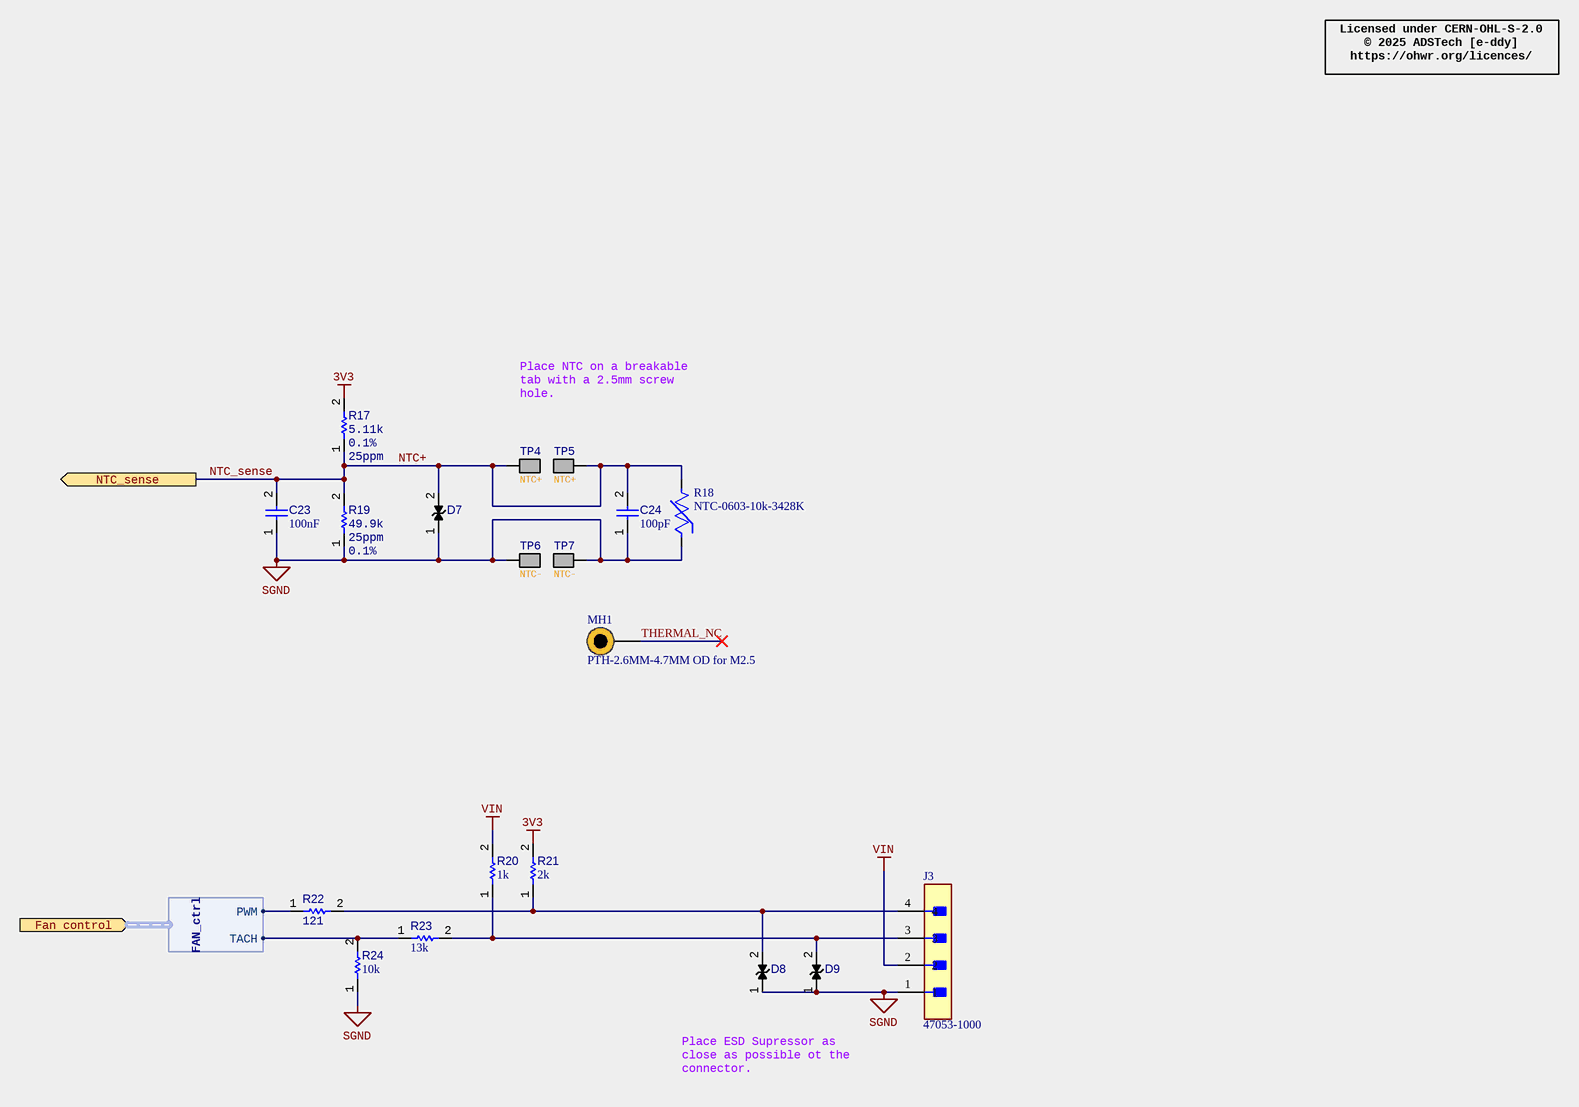
[diagram p4: Temperature and Fan.SchDoc]

### Parts
C23  value 100nF  [CAP_0402-IPC_B]  (hidden comment: C-0402-CER-X7R-100nF-10%-50V)
C24  value 100pF  [CAP_0402-IPC_B]  (hidden comment: C-0402-C0G-100pF-50V-1%)
D7  ESD-0603ESDA-MLP1  [CAP-0603-IPC_B]  (value not drawn)
D8  ESD-0603ESDA-MLP1  [CAP-0603-IPC_B]  (value not drawn)
D9  ESD-0603ESDA-MLP1  [CAP-0603-IPC_B]  (value not drawn)
J3  47053-1000  [FP-470531000-MFG]
MH1  PTH-2.6MM-4.7MM OD for M2.5  [PTH-2.6MM-4.7MM]  (net tie, no BOM)
R17  value 5.11k  Tolerance: 0.1%  TCR: 25ppm  [RES-0402-IPC_B]  (hidden comment: R-0402-5110.0-0.1%-25ppm-0.016)
R18  NTC-0603-10k-3428K  [FP-NCU18-0_15-MFG]
R19  value 49.9k  TCR: 25ppm  Tolerance: 0.1%  [RES-0402-IPC_B]  (hidden comment: R-0402-49900.0-0.1%-25ppm-0.016)
R20  value 1k  [RES-0402-IPC_B]  (hidden comment: R-0402-1000.0-1%-100ppm-0.5)
R21  value 2k  [RES-0402-IPC_B]  (hidden comment: R-0402-2000.0-1%-100ppm-0.5)
R22  value 121  [RES-0402-IPC_B]  (hidden comment: R-0402-121.0-1%-100ppm-0.5)
R23  value 13k  [RES-0402-IPC_B]  (hidden comment: R-0402-13000.0-1%-100ppm-0.5)
R24  value 10k  [RES-0402-IPC_B]  (hidden comment: R-0402-10000.0-1%-100ppm-0.5)
TP4  Name: NTC+  [3x2 pad]  (hidden comment: SMT-PAD-3x2)  (no BOM)
TP5  Name: NTC+  [3x2 pad]  (hidden comment: SMT-PAD-3x2)  (no BOM)
TP6  Name: NTC-  [3x2 pad]  (hidden comment: SMT-PAD-3x2)  (no BOM)
TP7  Name: NTC-  [3x2 pad]  (hidden comment: SMT-PAD-3x2)  (no BOM)

### Ports
Fan control (in, harness FAN_ctrl, see Block diagram[3C], MCU[1B]), NTC_sense (out, see Block diagram[3C], MCU[2C])

### Harnesses
FAN_ctrl: PWM, TACH

### Nets
3V3: R17.2 R21.2
SGND: C23.1 C24.1 D7.1(K) D8.1(K) D9.1(K) J3.1 R18.1 R19.1 R24.1 TP6.1 TP7.1
VIN: J3.2 R20.2
FAN_PWM: R22.1 ; port Fan control.PWM
FAN_TACHO: R23.1 R24.2 ; port Fan control.TACH
NTC+: C23.2 C24.2 D7.2(A) R17.1 R18.2 R19.2 TP4.1 TP5.1 ; port NTC_sense  [also labelled NTC_sense]
THERMAL_NC: MH1.0
NetD8_2: D8.2(A) J3.4 R21.1 R22.2
NetD9_2: D9.2(A) J3.3 R20.1 R23.2

### Notes on the sheet
- Licensed under CERN-OHL-S-2.0
  © 2025 ADSTech [e-ddy]
  https://ohwr.org/licences/
- Place NTC on a breakable tab with a 2.5mm screw hole.
- Place ESD Supressor as close as possible ot the connector.
- Size
- A3
- CCA No.
- Sheet:
- of
- Rev

### Library data of the parts
C23 = CMP-001-00003-5: as C1 on sheet PSU; Package Quantity: 50000; Pins: 2; Case Code (Imperial): 0402; RoHS Compliant: Yes; Voltage Rating (DC): 50V; Series: GRM; Max Operating Temperature: 125°C; Dielectric: X7R; Length: 0.039inch; Packaging: Tape and Reel; Thickness: 0.022inch; Material: Ceramic; Mounting Technology: Surface Mount; Tolerance: 10%; Lead Free: Lead Free; Case Code (Metric): 1005; Case/Package: 0402; Width: 0.02inch; Termination: SMD/SMT; Weight: 0.000212oz; Min Operating Temperature: -55°C; Height: 0.5mm
C24 = CMP-00082-3: Multilayer Ceramic Capacitors MLCC - SMD/SMT 50V 100pF C0G 0402 +/-1%; Tolerance: 1%; Package: 0402; Dielectric: C0G
D7-D9 = CMP-004-00006-1: Suppressor Esd 0.05PF 0603 SMD
J3 = CMP-04776-000290-2: CONN HEADER VERT 4POS 2.54MM; NexarPartId: 854935; Manufacturer Lifecycle Status: ACTIVE; Voltage Rating (DC): 250V; Gender: Male; Plating: Copper; Number of Positions: 4; Glow Wire Compliant: Non-compliant; Current Rating: 500mA; Max Operating Temperature: 75°C; Number of Rows: 1; REACH SVHC: Unknown; Ambient Temperature Range High: 105°C; Pitch: 2.54mm; Height: 7.7mm; Min Operating Temperature: 0°C; Packaging: Bulk; Contact Material: Brass, Copper; Contact Plating: Tin; Lead Pitch: 2.54mm; Voltage Rating: 250V; Termination: Through Hole; Radiation Hardening: No; Orientation: Vertical; Mount: Through Hole; Number of Pins: 4; Country of Origin: HK; Halogen Free: Low Halogen; Lifecycle Status: Production; Number of Circuits: 4; Schedule B: 8536694040, 8536694040; Housing Color: Beige; Housing Material: Nylon; Depth: 5.84mm; RoHS: Compliant; Length: 10.2mm; Number of Contacts: 4
MH1 = CMP-015-000007-1: 2.6mm/4.7mm PLATED TROUGH HOLE. For M2.5 Cylindrical hex screw head
R17 = RES-0402-00549-3: 0402 5110.0 Ω 0.1% 25ppm 0.016W Resistor; Power: 16mW; Package: 0402
R18 = CMP-010-00000-1: NTC Thermistor, 10000ohm, Surface Mount; Reference Standard: AEC-Q200; Power: 100mW; Thermistor Application: TEMPERATURE COMPENSATION; Value: 10kR; Tolerance: 1%; Rated Temperature: 25°C; Max Operating Temperature: 150°C; Resistor Type: NTC THERMISTOR; Pins: 2; RoHS Compliant: Yes; Terminal Placement: Dual Ended; Reach SVHC Compliant: Yes; Min Operating Temperature: -40°C; Termination: Wraparound; Mounting Technology: Surface Mount; Package Shape: Rectangular; Packaging: Tape and Reel
R19 = RES-0402-00644-3: 0402 49900.0 Ω 0.1% 25ppm 0.016W Resistor; Power: 16mW; Package: 0402
R20 = RES-0402-00192-5: as R15 on sheet MCU; TCR: 100ppm; Tolerance: 1%; Package: 0402
R21 = RES-0402-00221-5: 0402 2000.0 Ω 1% 100ppm 0.063W Resistor; MPN: CRCW04022K00FKED; Power: 63mW; TCR: 100ppm; Package: 0402; Tolerance: 1%
R22 = RES-0402-00104-5: 0402 121.0 Ω 1% 100ppm 0.063W Resistor; MPN: CRCW0402121RFKED; Power: 63mW; Package: 0402; Tolerance: 1%; TCR: 100ppm
R23 = RES-0402-00299-5: 0402 13000.0 Ω 1% 100ppm 0.063W Resistor; MPN: CRCW040213K0FKED; Power: 63mW; Tolerance: 1%; TCR: 100ppm; Package: 0402
R24 = RES-0402-00288-6: as R1 on sheet PSU; TCR: 100ppm; Package: 0402; Tolerance: 1%
TP4-TP7 = CMP-00096-1: 3x2mm standard pad for wire soldering

## Nets that join several sheets
3V3: PSU (5 pins), MCU (19 pins), Temperature and Fan (R17.2 R21.2)
SGND: Power Switch (O1.2), PSU (23 pins), MCU (24 pins), Temperature and Fan (11 pins)
VIN: PSU (6 pins), Temperature and Fan (J3.2 R20.2)
FAN_PWM: MCU (U3.16), Temperature and Fan (R22.1)
FAN_TACHO: MCU (U3.15), Temperature and Fan (R23.1 R24.2)
LOAD_EN: Power Switch (R7.2), MCU (R14.2 U3.40)
NTC+: MCU (U3.39), Temperature and Fan (8 pins)
USB_Dat_n: PSU (D1.5 D1.6 J2.A7 J2.B7), MCU (R9.2)
USB_Dat_p: PSU (D1.4 D1.7 J2.A6 J2.B6), MCU (R8.2)
VIN_sense: PSU (C25.2 R25.2 R26.1), MCU (U3.38)